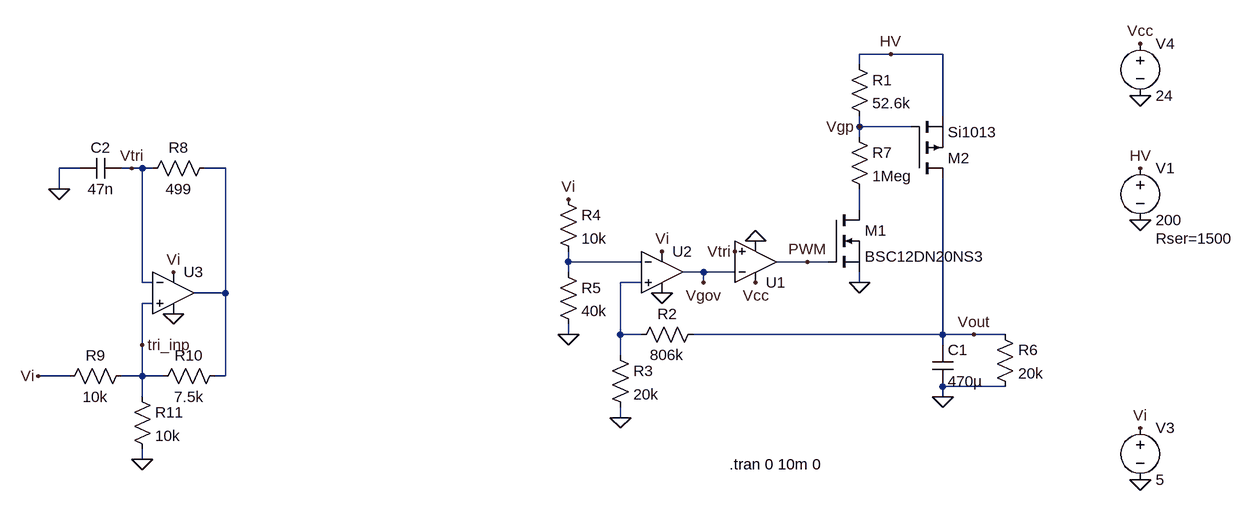
[diagram p0: schematic regulator.asc]
regulator.asc, the LTspice schematic file:
Version 4
SHEET 1 1636 680
WIRE 304 -16 256 -16
WIRE 384 -16 304 -16
WIRE 256 0 256 -16
WIRE 384 80 384 -16
WIRE 256 96 256 80
WIRE 336 96 256 96
WIRE 256 112 256 96
WIRE -944 160 -976 160
WIRE -864 160 -880 160
WIRE -848 160 -864 160
WIRE -832 160 -848 160
WIRE -720 160 -752 160
WIRE -976 192 -976 160
WIRE 256 224 256 192
WIRE -192 304 -192 288
WIRE -80 304 -192 304
WIRE 176 304 128 304
WIRE 208 304 176 304
WIRE -192 320 -192 304
WIRE 16 320 -16 320
WIRE 64 320 16 320
WIRE -848 336 -848 160
WIRE -832 336 -848 336
WIRE -80 336 -112 336
WIRE 16 336 16 320
WIRE 256 336 256 320
WIRE -720 352 -720 160
WIRE -720 352 -768 352
WIRE -832 368 -848 368
WIRE -192 416 -192 400
WIRE -112 416 -112 336
WIRE -80 416 -112 416
WIRE 384 416 384 176
WIRE 384 416 0 416
WIRE 432 416 384 416
WIRE 480 416 432 416
WIRE -848 432 -848 368
WIRE 384 432 384 416
WIRE -112 448 -112 416
WIRE -960 480 -1008 480
WIRE -848 480 -848 432
WIRE -848 480 -880 480
WIRE -816 480 -848 480
WIRE -720 480 -720 352
WIRE -720 480 -736 480
WIRE 480 496 384 496
WIRE -848 512 -848 480
WIRE 384 512 384 496
WIRE -112 544 -112 528
WIRE -848 608 -848 592
FLAG 256 336 0
FLAG 304 -16 HV
FLAG 688 240 0
FLAG 688 160 HV
FLAG 384 512 0
FLAG -112 544 0
FLAG 688 640 0
FLAG 688 560 Vi
FLAG -192 208 Vi
FLAG -192 416 0
FLAG -48 352 0
FLAG -48 288 Vi
FLAG 96 336 Vcc
FLAG 96 272 0
FLAG 432 416 Vout
FLAG 176 304 PWM
FLAG 16 336 Vgov
FLAG 256 96 Vgp
FLAG 688 48 0
FLAG 688 -32 Vcc
FLAG -800 384 0
FLAG -800 320 Vi
FLAG -848 608 0
FLAG -1008 480 Vi
FLAG -976 192 0
FLAG -864 160 Vtri
FLAG -848 432 tri_inp
FLAG 64 288 Vtri
SYMBOL nmos 208 224 R0
SYMATTR InstName M1
SYMATTR Value BSC12DN20NS3
SYMBOL pmos 336 176 M180
SYMATTR InstName M2
SYMATTR Value Si1013
SYMBOL res 240 -16 R0
SYMATTR InstName R1
SYMATTR Value 52.6k
SYMBOL cap 368 432 R0
SYMATTR InstName C1
SYMATTR Value 470µ
SYMBOL OpAmps\\UniversalOpAmp2 96 304 M180
SYMATTR InstName U1
SYMBOL OpAmps\\UniversalOpAmp2 -48 320 R0
SYMATTR InstName U2
SYMBOL res 16 400 R90
WINDOW 0 0 56 VBottom 2
WINDOW 3 32 56 VTop 2
SYMATTR InstName R2
SYMATTR Value 806k
SYMBOL res -128 432 R0
SYMATTR InstName R3
SYMATTR Value 20k
SYMBOL res -208 192 R0
SYMATTR InstName R4
SYMATTR Value 10k
SYMBOL res -208 304 R0
SYMATTR InstName R5
SYMATTR Value 40k
SYMBOL voltage 688 544 R0
WINDOW 123 0 0 Left 0
WINDOW 39 0 0 Left 0
SYMATTR InstName V3
SYMATTR Value 5
SYMBOL res 464 400 R0
SYMATTR InstName R6
SYMATTR Value 20k
SYMBOL res 240 96 R0
SYMATTR InstName R7
SYMATTR Value 1Meg
SYMBOL voltage 688 144 R0
WINDOW 123 0 0 Left 0
WINDOW 39 24 124 Left 2
SYMATTR SpiceLine Rser=1500
SYMATTR InstName V1
SYMATTR Value 200
SYMBOL voltage 688 -48 R0
SYMATTR InstName V4
SYMATTR Value 24
SYMBOL OpAmps\\UniversalOpAmp2 -800 352 R0
SYMATTR InstName U3
SYMBOL res -736 144 R90
WINDOW 0 0 56 VBottom 2
WINDOW 3 32 56 VTop 2
SYMATTR InstName R8
SYMATTR Value 499
SYMBOL res -864 464 R90
WINDOW 0 0 56 VBottom 2
WINDOW 3 32 56 VTop 2
SYMATTR InstName R9
SYMATTR Value 10k
SYMBOL res -720 464 R90
WINDOW 0 0 56 VBottom 2
WINDOW 3 32 56 VTop 2
SYMATTR InstName R10
SYMATTR Value 7.5k
SYMBOL res -864 496 R0
SYMATTR InstName R11
SYMATTR Value 10k
SYMBOL cap -880 144 R90
WINDOW 0 0 32 VBottom 2
WINDOW 3 32 32 VTop 2
SYMATTR InstName C2
SYMATTR Value 47n
SYMATTR SpiceLine IC=2
TEXT 56 616 Left 2 !.tran 0 10m 0

The netlist it stands for:
* regulator.asc
M1 N002 PWM 0 0 BSC12DN20NS3
M2 Vout Vgp HV HV Si1013
R1 HV Vgp 52.6k
C1 Vout 0 470µ
XU1 Vtri Vgov Vcc 0 PWM level2 Avol=1Meg GBW=10Meg Slew=10Meg Ilimit=25m Rail=0 Vos=0 En=0 Enk=0 In=0 Ink=0 Rin=500Meg  ; pins In+ In- V+ V- OUT
XU2 N004 N003 Vi 0 Vgov level2 Avol=1Meg GBW=10Meg Slew=10Meg Ilimit=25m Rail=0 Vos=0 En=0 Enk=0 In=0 Ink=0 Rin=500Meg  ; pins In+ In- V+ V- OUT
R2 Vout N004 806k
R3 N004 0 20k
R4 Vi N003 10k
R5 N003 0 40k
V3 Vi 0 5
R6 Vout 0 20k
R7 Vgp N002 1Meg
V1 HV 0 200 Rser=1500
V4 Vcc 0 24
XU3 tri_inp Vtri Vi 0 N001 level2 Avol=1Meg GBW=10Meg Slew=10Meg Ilimit=25m Rail=0 Vos=0 En=0 Enk=0 In=0 Ink=0 Rin=500Meg  ; pins In+ In- V+ V- OUT
R8 N001 Vtri 499
R9 tri_inp Vi 10k
R10 N001 tri_inp 7.5k
R11 tri_inp 0 10k
C2 Vtri 0 47n IC=2
.model NMOS NMOS
.model PMOS PMOS
.lib standard.mos
.tran 0 10m 0
.lib UniversalOpAmp2.lib
.backanno
.end